# EAGLE schematic sercon (EAGLE 9.4.2)
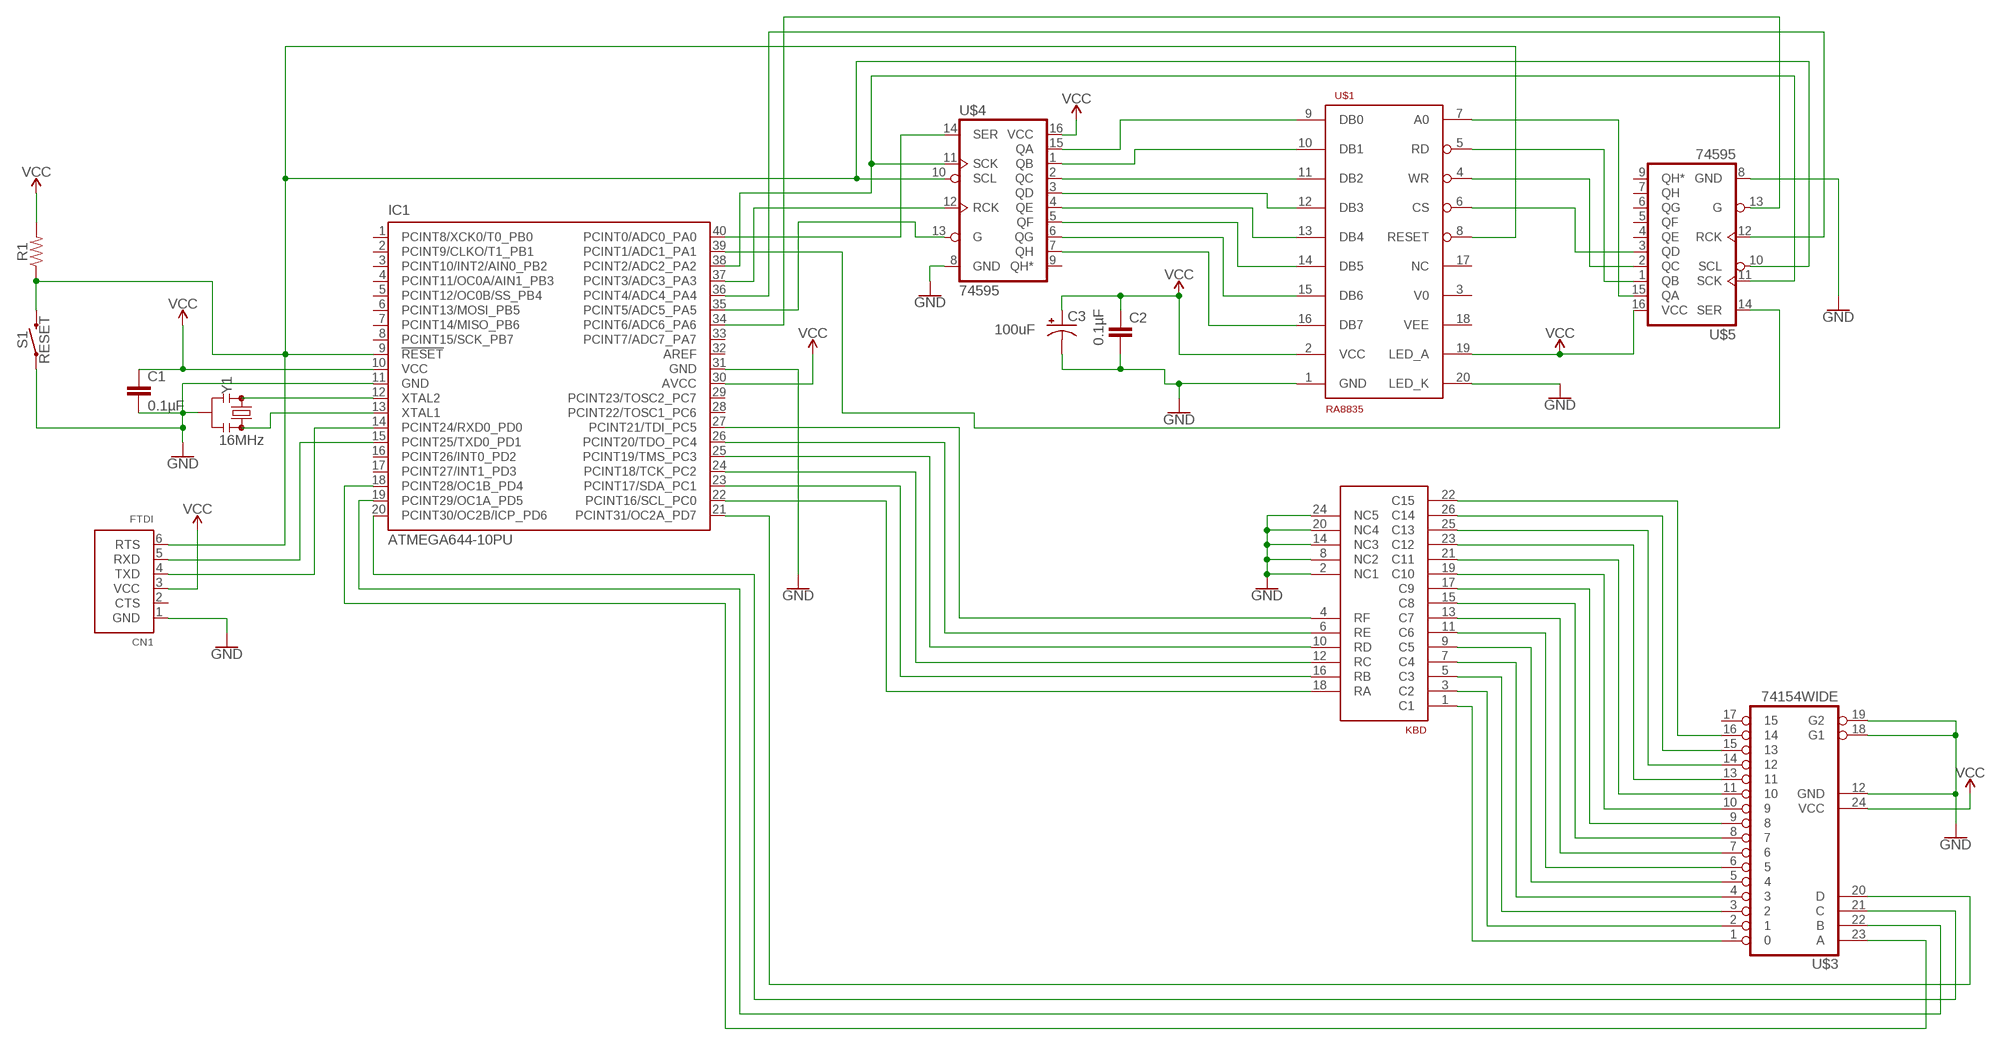
[diagram p0: schematic, sheet 1]

## Parts
C1  0.1µF  C2,5-3  [C2.5-3]
C2  0.1µF  C2,5-3  [C2.5-3]
C3  100uF  100UF-POLAR-RADIAL-2.5MM-25V-20%  [CPOL-RADIAL-2.5MM-6.5MM]
CN1  FTDI  FTDIUSBCABLE  [1X06_ROUND]
IC1  ATMEGA644-10PU  [DIL40]
R1  RESISTORAXIAL-0.3  [AXIAL-0.3]
S1  RESET  MOMENTARY-SWITCH-SPST-PTH-6.0MM  [TACTILE_SWITCH_PTH_6.0MM]
U$1  RA8835  [2X10]
U$2  5140KBD  [2X13]
U$3  74154WIDE  [DIL24-6]
U$4  74595  [DIL16]
U$5  74595  [DIL16]
Y1  16MHz  RESONATORPTH-7.6X3.8  [RESONATOR-PTH-7.6X3.8]

## Nets
GND: C1.2 C2.2 C3.2(-) CN1.1(GND) IC1.11(GND) IC1.31(GND) S1.1 U$1.1(GND) U$1.20(LED_K) U$2.2(NC1) U$2.8(NC2) U$2.14(NC3) U$2.20(NC4) U$2.24(NC5) U$3.12(GND) U$3.18(G1) U$3.19(G2) U$4.8(GND) U$5.8(GND) Y1.2
N$1: IC1.12(XTAL2) Y1.1
N$2: IC1.13(XTAL1) Y1.3
N$3: CN1.6(RTS) IC1.9(!RESET) R1.P$1 S1.3 U$1.8(RESET) U$4.10(SCL) U$5.10(SCL)
N$4: CN1.5(RXD) IC1.15(PCINT25/TXD0_PD1)
N$5: CN1.4(TXD) IC1.14(PCINT24/RXD0_PD0)
N$6: U$1.9(DB0) U$4.15(QA)
N$7: U$1.10(DB1) U$4.1(QB)
N$8: U$1.11(DB2) U$4.2(QC)
N$9: U$1.12(DB3) U$4.3(QD)
N$10: U$1.13(DB4) U$4.4(QE)
N$11: U$1.14(DB5) U$4.5(QF)
N$12: U$1.15(DB6) U$4.6(QG)
N$13: U$1.16(DB7) U$4.7(QH)
N$14: U$2.5(C3) U$3.3
N$15: U$2.7(C4) U$3.4
N$16: U$2.1(C1) U$3.1
N$17: U$2.3(C2) U$3.2
N$18: U$2.9(C5) U$3.5
N$19: U$2.11(C6) U$3.6
N$20: U$2.13(C7) U$3.7
N$21: U$2.15(C8) U$3.8
N$22: U$2.17(C9) U$3.9
N$23: U$2.19(C10) U$3.10
N$24: U$2.21(C11) U$3.11
N$25: U$2.23(C12) U$3.13
N$26: U$2.25(C13) U$3.14
N$27: U$2.26(C14) U$3.15
N$28: U$2.22(C15) U$3.16
N$29: U$1.7(A0) U$5.15(QA)
N$30: IC1.22(PCINT16/SCL_PC0) U$2.18(RA)
N$31: IC1.23(PCINT17/SDA_PC1) U$2.16(RB)
N$32: IC1.24(PCINT18/TCK_PC2) U$2.12(RC)
N$33: IC1.25(PCINT19/TMS_PC3) U$2.10(RD)
N$34: IC1.26(PCINT20/TDO_PC4) U$2.6(RE)
N$35: IC1.27(PCINT21/TDI_PC5) U$2.4(RF)
N$36: IC1.21(PCINT31/OC2A_PD7) U$3.20(D)
N$37: IC1.20(PCINT30/OC2B/ICP_PD6) U$3.21(C)
N$38: IC1.19(PCINT29/OC1A_PD5) U$3.22(B)
N$39: IC1.18(PCINT28/OC1B_PD4) U$3.23(A)
N$40: IC1.40(PCINT0/ADC0_PA0) U$4.14(SER)
N$41: IC1.39(PCINT1/ADC1_PA1) U$5.14(SER)
N$42: IC1.38(PCINT2/ADC2_PA2) U$4.11(SCK) U$5.11(SCK)
N$43: IC1.37(PCINT3/ADC3_PA3) U$4.12(RCK)
N$44: U$1.5(RD) U$5.1(QB)
N$45: U$1.4(WR) U$5.2(QC)
N$46: U$1.6(CS) U$5.3(QD)
N$48: IC1.36(PCINT4/ADC4_PA4) U$5.12(RCK)
N$49: IC1.34(PCINT6/ADC6_PA6) U$5.13(G)
N$50: IC1.35(PCINT5/ADC5_PA5) U$4.13(G)
VCC: C1.1 C2.1 C3.1(+) CN1.3(VCC) IC1.10(VCC) IC1.30(AVCC) R1.P$2 U$1.2(VCC) U$1.19(LED_A) U$3.24(VCC) U$4.16(VCC) U$5.16(VCC)
Unconnected: CN1.2(CTS) IC1.1(PCINT8/XCK0/T0_PB0) IC1.2(PCINT9/CLKO/T1_PB1) IC1.3(PCINT10/INT2/AIN0_PB2) IC1.4(PCINT11/OC0A/AIN1_PB3) IC1.5(PCINT12/OC0B/SS_PB4) IC1.6(PCINT13/MOSI_PB5) IC1.7(PCINT14/MISO_PB6) IC1.8(PCINT15/SCK_PB7) IC1.16(PCINT26/INT0_PD2) IC1.17(PCINT27/INT1_PD3) IC1.28(PCINT22/TOSC1_PC6) IC1.29(PCINT23/TOSC2_PC7) IC1.32(AREF) IC1.33(PCINT7/ADC7_PA7) U$1.3(V0) U$1.17(NC) U$1.18(VEE) U$3.17 U$4.9(QH*) U$5.4(QE) U$5.5(QF) U$5.6(QG) U$5.7(QH) U$5.9(QH*)

## Library data of the parts
C1 C2 = capacitor-wima:C: CAPACITOR naming: grid - package width
C3 = SparkFun-Capacitors:100UF-POLAR: 100µF polarized capacitors A capacitor is a passive two-terminal electrical component used to store electrical energy temporarily in an electric field.; PROD_ID: CAP-08439
CN1 = microbuilder:FTDIUSBCABLE: FTDI TTL-232R USB Cable Connector for FTDI's USB->RS232 Cable
IC1 = atmel:ATMEGA644-*PU: 8-bit Microcontroller with 64K Bytes In-System Programmable Flash Auto generated by make-symbol-device-package-bsdl.ulp Rev. 34 Source: http://www.atmel.com/dyn/resources/prod_documents/doc2593.pdf; MPN: ATMEGA644V-10PU; OC_FARNELL: 1288342; OC_NEWARK: 23M5062
R1 = SparkFun-Resistors:RESISTOR: Generic Resistor Package
S1 = SparkFun-Switches:MOMENTARY-SWITCH-SPST: Momentary Switch (Pushbutton) - SPST Normally-open (NO) SPST momentary switches (buttons, pushbuttons). Variants PTH-12MM - 12mm square, through-hole Momentary Pushbutton Switch - 12mm Square <https://www.sparkfun.com/products/9190> (COM-09190) PTH-6.0MM, PTH-6.0MM-KIT - 6.0mm square, through-hole Mini Pushbutton Switch <https://www.sparkfun.com/products/97> (COM-00097) KIT package intended for soldering kit's - only one side of pads' copper is exposed. PTH-RIGHT-ANGLE-KIT - Right-angle, through-hole Right Angle Tactile Button <https://www.sparkfun.com/products/10791> - Used on SparkFun BigTime Watch Kit <https://www.sparkfun.com/products/11734> SMD-12MM - 12mm square, surface-mount Tactile Button - SMD (12mm) <https://www.sparkfun.com/products/12993> (COM-12993) Used on SparkFun PicoBoard <https://www.sparkfun.com/products/11888> SMD-4.5MM - 4.5mm Square Trackball Switch Used on SparkFun Blackberry Trackballer Breakout <https://www.sparkfun.com/products/13169> SMD-4.6MMX2.8MM - 4.60mm x 2.80mm, surface mount Used on SparkFun SAMD21 Mini Breakout <https://www.sparkfun.com/products/13664> SMD-5.2MM, SMD-5.2-REDUNDANT - 5.2mm square, surface-mount Mini Pushbutton Switch - SMD <https://www.sparkfun.com/products/8720> (COM-08720) Used on Arduino Pro Mini <https://www.sparkfun.com/products/11114> REDUNDANT package connects both switch circuits together SMD-6.0X3.5MM - 6.0 x 3.5mm, surface mount Momentary Reset Switch SMD <https://www.sparkfun.com/products/8229> (COM-08229) SMD-6.2MM-TALL - 6.2mm square, surface mount Tactile Button - SMD (6mm) <https://www.sparkfun.com/products/12992> Used on SparkFun Digital Sandbox <https://www.sparkfun.com/products/12651> SMD-RIGHT-ANGLE - Right-angle, surface mount Used on SparkFun Block for Intel® Edison - Arduino <https://www.sparkfun.com/products/13036>; PROD_ID: SWCH-08441; SF_SKU: COM-00097
U$1 = wntrmute:RA8835
U$2 = wntrmute:5140KBD
U$3 = wntrmute:74154
U$4 U$5 = wntrmute:74595
Y1 = SparkFun-Clocks:RESONATOR: Resonators (Generic) Ceramic resonators are clock-generating components, often used to control timing in microcontrollers. They usually have 3 pins: two pins for oscillation, and one pin for ground. Compared to crystals, resonators have worse tolerance, but are usually much cheaper. Plus, they have built-in load capacitors! These devices are used on boards like the Arduino Pro 8MHz <https://www.sparkfun.com/products/11114> and Arduino Pro 16MHz <https://www.sparkfun.com/products/11113>.